# EAGLE design LnControlPanel (EAGLE 9.6.2)

## Sheet 1 of 3
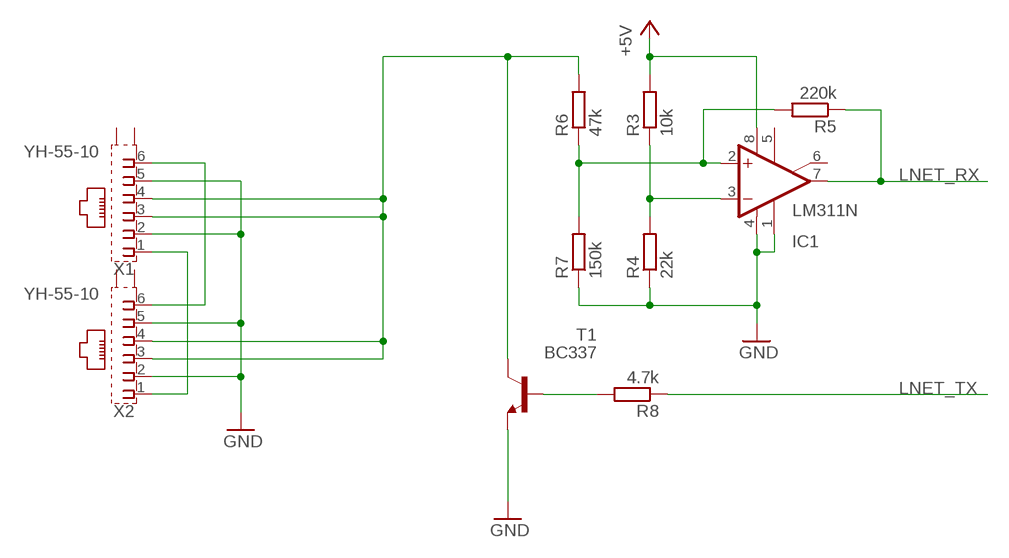
[diagram p0: schematic, sheet 1]

### Parts
IC1  LM311N  [DIL08]
R3  10k  R-EU_0207/2V  [0207/2V]
R4  22k  R-EU_0207/2V  [0207/2V]
R5  220k  R-EU_0207/2V  [0207/2V]
R6  47k  R-EU_0207/2V  [0207/2V]
R7  150k  R-EU_0207/2V  [0207/2V]
R8  4.7k  R-EU_0207/2V  [0207/2V]
T1  BC337  [TO92]
X1  YH-55-10  [YH-55-10]
X2  YH-55-10  [YH-55-10]

### Nets
+5V [power]: IC1.8(V+) R3.2 ; also sheet 2,3
GND [power]: IC1.1(GND) IC1.4(V-) R4.1 R7.1 T1.1(E) X1.2 X1.5 X2.2 X2.5 ; also sheet 2,3
LNET: R6.2 T1.3(C) X1.3 X1.4 X2.3 X2.4
LNET_RX: IC1.7(OUT) R5.1 ; also sheet 2
LNET_TX: R8.1 ; also sheet 2
N$1: R8.2 T1.2(B)
N$3: IC1.3(-IN) R3.1 R4.2
N$5: IC1.2(+IN) R5.2 R6.1 R7.2
N$41: X1.1 X2.1
N$42: X1.6 X2.6
Unconnected: IC1.5(ON) IC1.6(ON/STR) X1.S1(S) X1.S2(S) X2.S1(S) X2.S2(S)

## Sheet 2 of 3
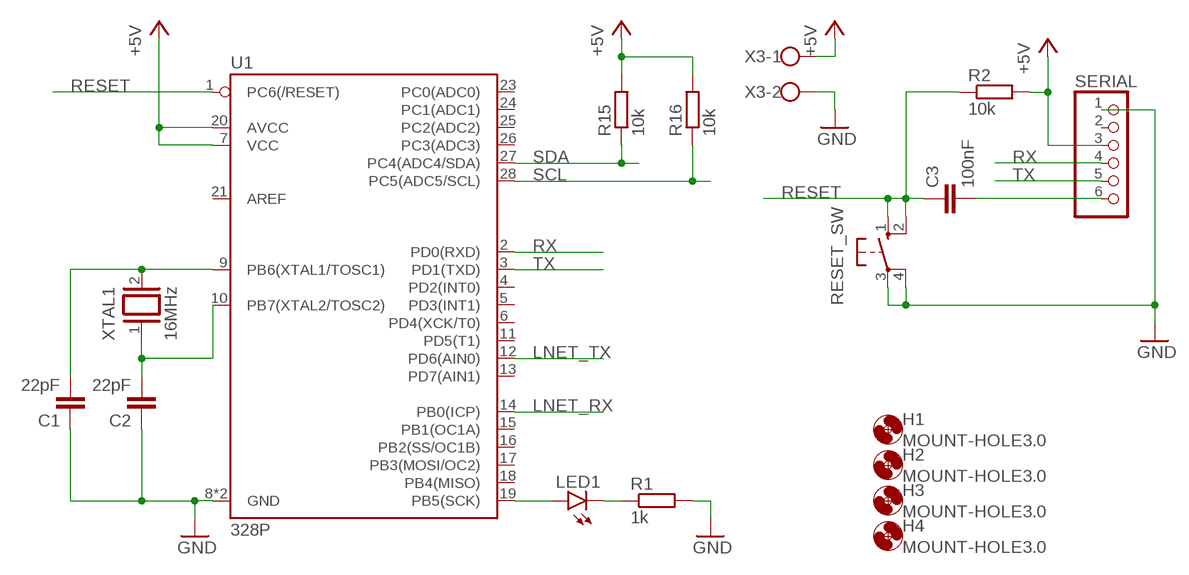
[diagram p1: schematic, sheet 2]

### Parts
C1  22pF  C-EU025-025X050  [C025-025X050]
C2  22pF  C-EU025-025X050  [C025-025X050]
C3  100nF  C-EU050-030X075  [C050-030X075]
H1  MOUNT-HOLE3.0  [3,0]
H2  MOUNT-HOLE3.0  [3,0]
H3  MOUNT-HOLE3.0  [3,0]
H4  MOUNT-HOLE3.0  [3,0]
LED1  LED3MM  [LED3MM]
R1  1k  R-EU_0207/2V  [0207/2V]
R2  10k  R-EU_0207/2V  [0207/2V]
R15  10k  R-EU_0207/2V  [0207/2V]
R16  10k  R-EU_0207/2V  [0207/2V]
RESET_SW  10-XX  [B3F-10XX]
SERIAL  PINHD-1X6  [1X06]
U1  328P  ATMEGA328P_PDIP  [DIP28]
X3  W237-102  [W237-102]
XTAL1  16MHz  XTAL/S  [QS]

### Nets
+5V [power]: R2.2 R15.2 R16.2 SERIAL.3 U1.7(VCC) U1.20(AVCC) X3.1 ; also sheet 1,3
GND [power]: C1.1 C2.1 R1.2 RESET_SW.3(P) RESET_SW.4(P1) SERIAL.1 U1.8(GND) U1.22(GND) X3.2 ; also sheet 1,3
LNET_RX: U1.14(PB0(ICP)) ; also sheet 1
LNET_TX: U1.12(PD6(AIN0)) ; also sheet 1
N$2: C2.2 U1.10(PB7(XTAL2/TOSC2)) XTAL1.1
N$4: C1.2 U1.9(PB6(XTAL1/TOSC1)) XTAL1.2
N$38: C3.2 SERIAL.6
N$39: LED1.A U1.19(PB5(SCK))
N$40: LED1.K(C) R1.1
RESET: C3.1 R2.1 RESET_SW.1(S) RESET_SW.2(S1) U1.1(PC6(/RESET))
RX: SERIAL.4 U1.2(PD0(RXD))
SCL: R16.1 U1.28(PC5(ADC5/SCL)) ; also sheet 3
SDA: R15.1 U1.27(PC4(ADC4/SDA)) ; also sheet 3
TX: SERIAL.5 U1.3(PD1(TXD))
Unconnected: SERIAL.2 U1.4(PD2(INT0)) U1.5(PD3(INT1)) U1.6(PD4(XCK/T0)) U1.11(PD5(T1)) U1.13(PD7(AIN1)) U1.15(PB1(OC1A)) U1.16(PB2(SS/OC1B)) U1.17(PB3(MOSI/OC2)) U1.18(PB4(MISO)) U1.21(AREF) U1.23(PC0(ADC0)) U1.24(PC1(ADC1)) U1.25(PC2(ADC2)) U1.26(PC3(ADC3))

## Sheet 3 of 3
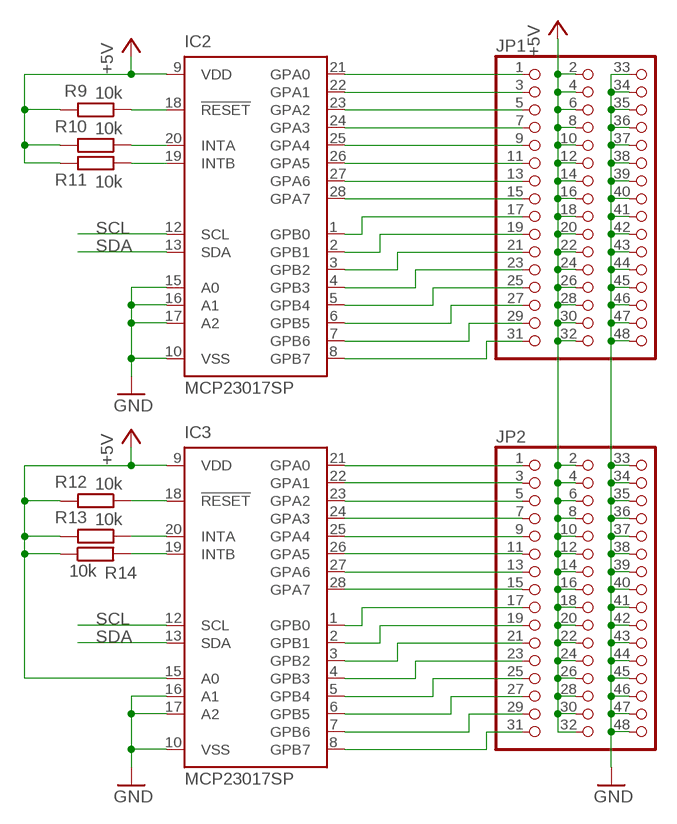
[diagram p2: schematic, sheet 3]

### Parts
IC2  MCP23017SP  [DIL28-3]
IC3  MCP23017SP  [DIL28-3]
JP1  PINHD-3X16  [3X16]
JP2  PINHD-3X16  [3X16]
R9  10k  R-EU_0207/2V  [0207/2V]
R10  10k  R-EU_0207/2V  [0207/2V]
R11  10k  R-EU_0207/2V  [0207/2V]
R12  10k  R-EU_0207/2V  [0207/2V]
R13  10k  R-EU_0207/2V  [0207/2V]
R14  10k  R-EU_0207/2V  [0207/2V]

### Nets
+5V [power]: IC2.9(VDD) IC3.9(VDD) IC3.15(A0) JP1.2 JP1.4 JP1.6 JP1.8 JP1.10 JP1.12 JP1.14 JP1.16 JP1.18 JP1.20 JP1.22 JP1.24 JP1.26 JP1.28 JP1.30 JP1.32 JP2.2 JP2.4 JP2.6 JP2.8 JP2.10 JP2.12 JP2.14 JP2.16 JP2.18 JP2.20 JP2.22 JP2.24 JP2.26 JP2.28 JP2.30 JP2.32 R9.2 R10.2 R11.2 R12.2 R13.2 R14.1 ; also sheet 1,2
GND [power]: IC2.10(VSS) IC2.15(A0) IC2.16(A1) IC2.17(A2) IC3.10(VSS) IC3.16(A1) IC3.17(A2) JP1.33 JP1.34 JP1.35 JP1.36 JP1.37 JP1.38 JP1.39 JP1.40 JP1.41 JP1.42 JP1.43 JP1.44 JP1.45 JP1.46 JP1.47 JP1.48 JP2.33 JP2.34 JP2.35 JP2.36 JP2.37 JP2.38 JP2.39 JP2.40 JP2.41 JP2.42 JP2.43 JP2.44 JP2.45 JP2.46 JP2.47 JP2.48 ; also sheet 1,2
N$6: IC2.21(GPA0) JP1.1
N$7: IC2.22(GPA1) JP1.3
N$8: IC2.23(GPA2) JP1.5
N$9: IC2.24(GPA3) JP1.7
N$10: IC2.25(GPA4) JP1.9
N$11: IC2.26(GPA5) JP1.11
N$12: IC2.27(GPA6) JP1.13
N$13: IC2.28(GPA7) JP1.15
N$14: IC2.1(GPB0) JP1.17
N$15: IC2.2(GPB1) JP1.19
N$16: IC2.3(GPB2) JP1.21
N$17: IC2.4(GPB3) JP1.23
N$18: IC2.5(GPB4) JP1.25
N$19: IC2.6(GPB5) JP1.27
N$20: IC2.7(GPB6) JP1.29
N$21: IC2.8(GPB7) JP1.31
N$22: IC3.21(GPA0) JP2.1
N$23: IC3.22(GPA1) JP2.3
N$24: IC3.23(GPA2) JP2.5
N$25: IC3.24(GPA3) JP2.7
N$26: IC3.25(GPA4) JP2.9
N$27: IC3.26(GPA5) JP2.11
N$28: IC3.27(GPA6) JP2.13
N$29: IC3.28(GPA7) JP2.15
N$30: IC3.1(GPB0) JP2.17
N$31: IC3.2(GPB1) JP2.19
N$32: IC3.3(GPB2) JP2.21
N$33: IC3.4(GPB3) JP2.23
N$34: IC3.5(GPB4) JP2.25
N$35: IC3.6(GPB5) JP2.27
N$36: IC3.7(GPB6) JP2.29
N$37: IC3.8(GPB7) JP2.31
N$43: IC3.18(!RESET) R12.1
N$44: IC2.18(!RESET) R9.1
N$45: IC2.20(INTA) R10.1
N$46: IC2.19(INTB) R11.1
N$47: IC3.20(INTA) R13.1
N$48: IC3.19(INTB) R14.2
SCL: IC2.12(SCL) IC3.12(SCL) ; also sheet 2
SDA: IC2.13(SDA) IC3.13(SDA) ; also sheet 2

## Library data of the parts
C1-C3 = rcl:C-EU: CAPACITOR, European symbol; SPICEPREFIX: C
H1-H4 = holes:MOUNT-HOLE: MOUNTING HOLE with drill center marker
IC1 = linear:LM311: COMPARATOR
IC2 IC3 = microchip:MCP23017: http://ww1.microchip.com/downloads/en/DeviceDoc/21952a.pdf Source: http://ww1.microchip.com/downloads/en/DeviceDoc/21952a.pdf; MF: MICROCHIP; MPN: MCP23017-E/SP; OC_FARNELL: 1332088; OC_NEWARK: 31K2959
JP1 JP2 = LucaDentella:PINHD-3X16: PIN HEADER
LED1 = led:LED: LED OSRAM: - CHIPLED LG R971, LG N971, LY N971, LG Q971, LY Q971, LO R971, LY R971 LH N974, LH R974 LS Q976, LO Q976, LY Q976 LO Q996 - Hyper CHIPLED LW Q18S LB Q993, LB Q99A, LB R99A - SideLED LS A670, LO A670, LY A670, LG A670, LP A670 LB A673, LV A673, LT A673, LW A673 LH A674 LY A675 LS A676, LA A676, LO A676, LY A676, LW A676 LS A679, LY A679, LG A679 - Hyper Micro SIDELED® LS Y876, LA Y876, LO Y876, LY Y876 LT Y87S - SmartLED LW L88C, LW L88S LB L89C, LB L89S, LG L890 LS L89K, LO L89K, LY L89K LS L896, LA L896, LO L896, LY L896 - TOPLED LS T670, LO T670, LY T670, LG T670, LP T670 LSG T670, LSP T670, LSY T670, LOP T670, LYG T670 LG T671, LOG T671, LSG T671 LB T673, LV T673, LT T673, LW T673 LH T674 LS T676, LA T676, LO T676, LY T676, LB T676, LH T676, LSB T676, LW T676 LB T67C, LV T67C, LT T67C, LS T67K, LO T67K, LY T67K, LW E67C LS E67B, LA E67B, LO E67B, LY E67B, LB E67C, LV E67C, LT E67C LW T67C LS T679, LY T679, LG T679 LS T770, LO T770, LY T770, LG T770, LP T770 LB T773, LV T773, LT T773, LW T773 LH T774 LS E675, LA E675, LY E675, LS T675 LS T776, LA T776, LO T776, LY T776, LB T776 LHGB T686 LT T68C, LB T68C - Hyper Mini TOPLED® LB M676 - Mini TOPLED Santana® LG M470 LS M47K, LO M47K, LY M47K Source: http://www.osram.convergy.de LUXEON: - LUMILED® LXK2-PW12-R00, LXK2-PW12-S00, LXK2-PW14-U00, LXK2-PW14-V00 LXK2-PM12-R00, LXK2-PM12-S00, LXK2-PM14-U00 LXK2-PE12-Q00, LXK2-PE12-R00, LXK2-PE12-S00, LXK2-PE14-T00, LXK2-PE14-U00 LXK2-PB12-K00, LXK2-PB12-L00, LXK2-PB12-M00, LXK2-PB14-N00, LXK2-PB14-P00, LXK2-PB14-Q00 LXK2-PR12-L00, LXK2-PR12-M00, LXK2-PR14-Q00, LXK2-PR14-R00 LXK2-PD12-Q00, LXK2-PD12-R00, LXK2-PD12-S00 LXK2-PH12-R00, LXK2-PH12-S00 LXK2-PL12-P00, LXK2-PL12-Q00, LXK2-PL12-R00 Source: www.luxeon.com KINGBRIGHT: KA-3528ASYC Source: www.kingbright.com
R1 R2 R15 R16 = rcl:R-EU_: RESISTOR, European symbol; SPICEPREFIX: R
R3-R14 = rcl:R-EU_: RESISTOR, European symbol
RESET_SW = switch-omron:10-XX: OMRON SWITCH; MPN: B3F-1000; OC_FARNELL: 176432; OC_NEWARK: 36M3542
SERIAL = pinhead:PINHD-1X6: PIN HEADER
T1 = transistor:BC337: NPN TRANSISTOR
U1 = SparkFun-IC-Microcontroller:ATMEGA328P_PDIP: Atmel 328P Through hole ATMEGA328P uC used in the Arduino 32kb flash, 1k EEPROM, 2k SRAM Datasheet <http://www.sparkfun.com/datasheets/Components/SMD/ATMega328.pdf> SparkFun Products Storefront component: AVR 28 Pin 20MHz 32K 6A/D - ATMega328P <https://www.sparkfun.com/products/9061> (COM-09061) SparkFun Simon Says - Through-Hole Soldering Kit <https://www.sparkfun.com/products/10547> (KIT-10547) SparkFun Learn to Solder - Simon Says <https://www.sparkfun.com/products/13708> (KIT-13708) SparkFun BigTime Watch Kit <https://www.sparkfun.com/products/11734> (KIT-11734) SparkFun ClockIt <https://www.sparkfun.com/products/10930> (KIT-10930) SparkFun Serial Enabled LCD Kit <https://www.sparkfun.com/products/10097> (LCD-10097) SparkFun Simon Tilts - Through Hole Soldering Kit <https://www.sparkfun.com/products/12634> (KIT-12634) SparkFun Frequency Counter Kit <https://www.sparkfun.com/products/10140> (KIT-10140) FabFM Radio Kit <https://www.sparkfun.com/products/11043> (KIT-11043) SparkFun Binary Blaster Kit <https://www.sparkfun.com/products/12037> (KIT-12037) SparkFun Metro-Gnome <https://www.sparkfun.com/products/9236> (KIT-09236) ATmega328 with Arduino Optiboot (Uno) <https://www.sparkfun.com/products/10524> (DEV-10524); PROD_ID: IC-09136
X1 X2 = con-wenzhou-yihua:YH-55-10: RJ11 6 connects Source: YH-55-10.pdf; OC_FARNELL: unknown; OC_NEWARK: unknown
X3 = con-wago-500:W237-102: WAGO SCREW CLAMP; MPN: 237-102; OC_FARNELL: unknown; OC_NEWARK: 70K9898
XTAL1 = special:XTAL/S: CRYSTAL

## Net classes
0 default: width 0.254 mm, clearance 0.254 mm
1 power: width 0.508 mm, clearance 0.254 mm

## Board
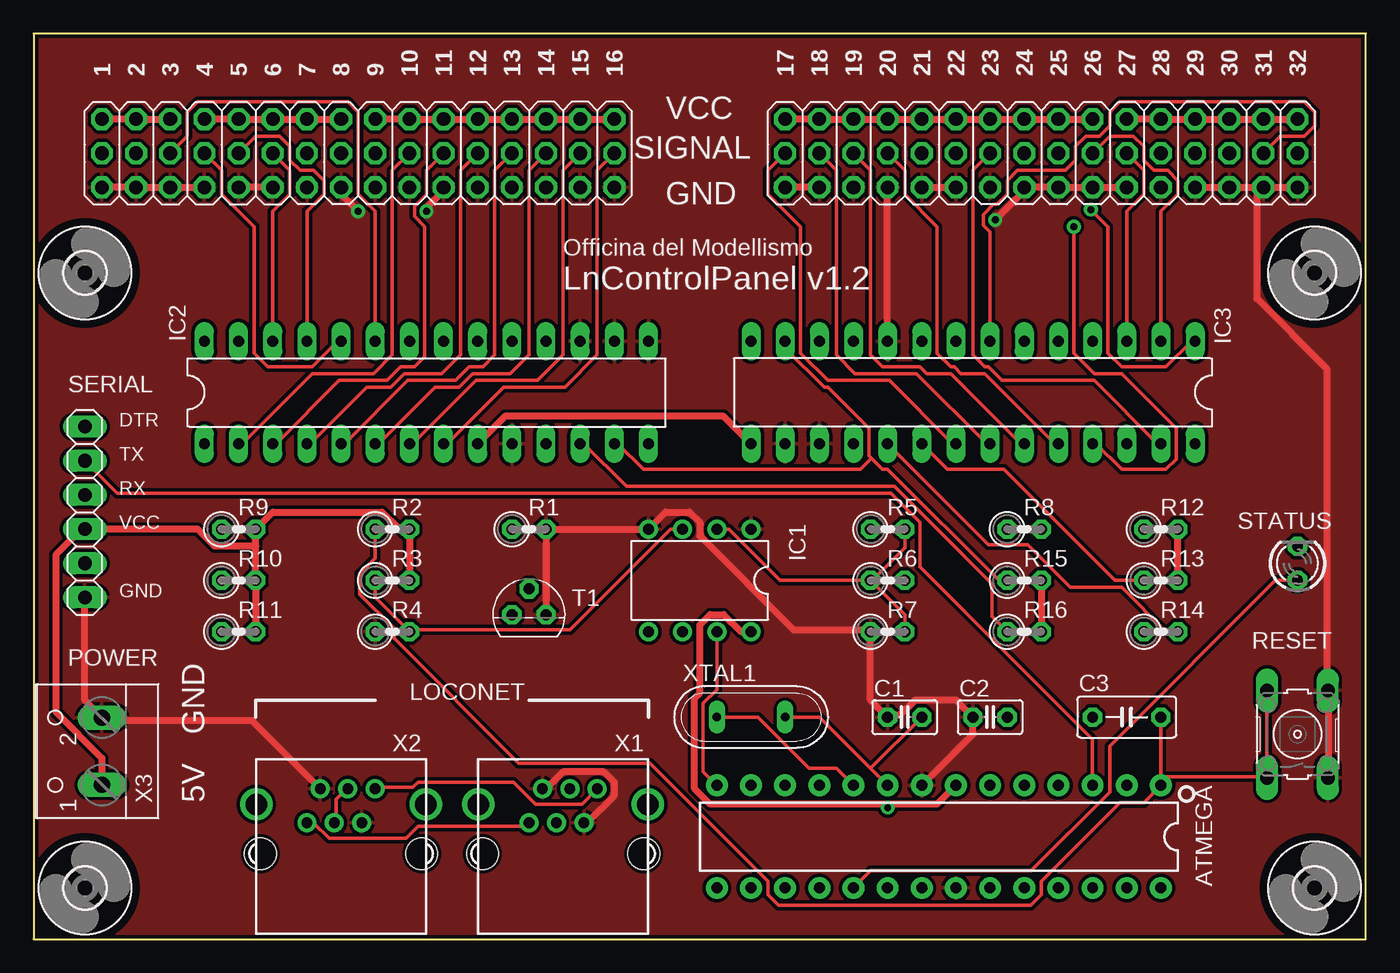
[diagram p3: board, top side]
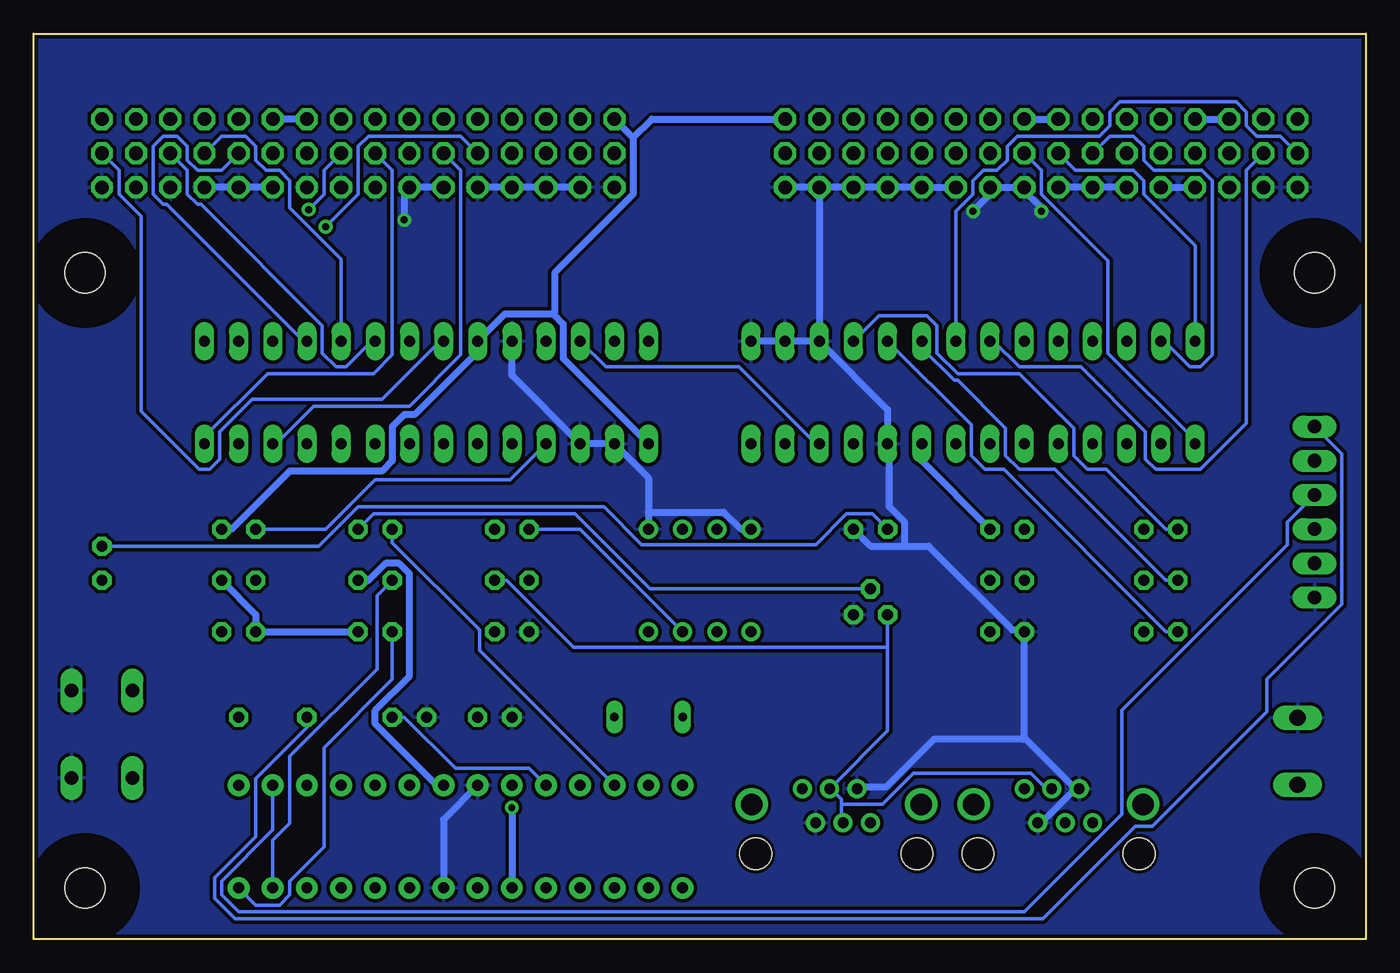
[diagram p4: board, bottom side, seen from below]

Size 99.06 x 67.31 mm. Coordinates in mm from the lower left corner, seen from the top.
Outline: 0,0 99.06,0 99.06,67.31 0,67.31 0,0
Copper layers (1*16): Top 0.035mm / dielectric 1.5mm / Bottom 0.035mm
Design rules "SparkFun": minimum track width 8mil, minimum drill 20mil, track to track 8mil, track to pad 8mil, pad to pad 8mil, via to via 8mil, smd to smd 8mil, copper to edge 10mil, drill to drill 8mil, minimum pad ring 12mil, minimum via ring 10mil, stop-mask expansion 4mil, vias tented up to drill 25mil, thermal gap 10mil

### Footprints (pad centres in the part's own frame; a part is rotated, then mirrored left to right if it is on the bottom)
C025-025X050 = drill 0.813 octagon: 1 -1.27,0; 2 1.27,0
C050-030X075 = drill 0.813 octagon: 1 -2.54,0; 2 2.54,0
3,0 = hole 3: 0,0
DIL08 = drill 0.813 pad 1.27: 1 -3.81,-3.81; 2 -1.27,-3.81; 3 1.27,-3.81; 4 3.81,-3.81; 5 3.81,3.81; 6 1.27,3.81; 7 -1.27,3.81; 8 -3.81,3.81
DIL28-3 = drill 0.813 long: 1 -16.51,-3.81; 2 -13.97,-3.81; 3 -11.43,-3.81; 4 -8.89,-3.81; 5 -6.35,-3.81; 6 -3.81,-3.81; 7 -1.27,-3.81; 8 1.27,-3.81; 9 3.81,-3.81; 10 6.35,-3.81; 11 8.89,-3.81; 12 11.43,-3.81; 13 13.97,-3.81; 14 16.51,-3.81; 15 16.51,3.81; 16 13.97,3.81; 17 11.43,3.81; 18 8.89,3.81; 19 6.35,3.81; 20 3.81,3.81; 21 1.27,3.81; 22 -1.27,3.81; 23 -3.81,3.81; 24 -6.35,3.81; 25 -8.89,3.81; 26 -11.43,3.81; 27 -13.97,3.81; 28 -16.51,3.81
3X16 = drill 1.016 octagon: 1 -19.05,-1.27; 2 -19.05,1.27; 3 -16.51,-1.27; 4 -16.51,1.27; 5 -13.97,-1.27; 6 -13.97,1.27; 7 -11.43,-1.27; 8 -11.43,1.27; 9 -8.89,-1.27; 10 -8.89,1.27; 11 -6.35,-1.27; 12 -6.35,1.27; 13 -3.81,-1.27; 14 -3.81,1.27; 15 -1.27,-1.27; 16 -1.27,1.27; 17 1.27,-1.27; 18 1.27,1.27; 19 3.81,-1.27; 20 3.81,1.27; 21 6.35,-1.27; 22 6.35,1.27; 23 8.89,-1.27; 24 8.89,1.27; 25 11.43,-1.27; 26 11.43,1.27; 27 13.97,-1.27; 28 13.97,1.27; 29 16.51,-1.27; 30 16.51,1.27; 31 19.05,-1.27; 32 19.05,1.27; 33 -19.05,-3.81; 34 -16.51,-3.81; 35 -13.97,-3.81; 36 -11.43,-3.81; 37 -8.89,-3.81; 38 -6.35,-3.81; 39 -3.81,-3.81; 40 -1.27,-3.81; 41 1.27,-3.81; 42 3.81,-3.81; 43 6.35,-3.81; 44 8.89,-3.81; 45 11.43,-3.81; 46 13.97,-3.81; 47 16.51,-3.81; 48 19.05,-3.81
LED3MM = drill 0.813 octagon: A -1.27,0; K 1.27,0
0207/2V = drill 0.813 octagon: 1 -1.27,0; 2 1.27,0
B3F-10XX = drill 1.016 long: 1 -3.251,2.261; 2 3.251,2.261; 3 -3.251,-2.261; 4 3.251,-2.261
1X06 = drill 1.016 long: 1 -6.35,0; 2 -3.81,0; 3 -1.27,0; 4 1.27,0; 5 3.81,0; 6 6.35,0
TO92 = drill 0.813 octagon: 1 1.27,0; 2 0,1.905; 3 -1.27,0
DIP28 = drill 0.813 pad 1.626: 1 -16.51,-3.81; 2 -13.97,-3.81; 3 -11.43,-3.81; 4 -8.89,-3.81; 5 -6.35,-3.81; 6 -3.81,-3.81; 7 -1.27,-3.81; 8 1.27,-3.81; 9 3.81,-3.81; 10 6.35,-3.81; 11 8.89,-3.81; 12 11.43,-3.81; 13 13.97,-3.81; 14 16.51,-3.81; 15 16.51,3.81; 16 13.97,3.81; 17 11.43,3.81; 18 8.89,3.81; 19 6.35,3.81; 20 3.81,3.81; 21 1.27,3.81; 22 -1.27,3.81; 23 -3.81,3.81; 24 -6.35,3.81; 25 -8.89,3.81; 26 -11.43,3.81; 27 -13.97,3.81; 28 -16.51,3.81
YH-55-10 = drill 0.8 pad 1.3: 1 -2.54,2.3; 2 -1.54,4.84; 3 -0.5,2.3; 4 0.5,4.84; 5 1.54,2.3; 6 2.54,4.84 | drill 1.6 pad 2.184: S1 -6.3,3.68; S2 6.3,3.68 | hole 2.36: -6,0; 6,0
W237-102 = drill 1.194 long: 1 -2.5,-1.27; 2 2.5,-1.27
QS = drill 0.61 long: 1 -2.54,0; 2 2.54,0

### Placement (x,y rotation side)
C1  64.77,16.51 0 top
C2  71.12,16.51 0 top
C3  81.28,16.51 180 top
H1  3.81,49.53 0 top
H2  95.25,49.53 0 top
H3  3.81,3.81 0 top
H4  95.25,3.81 0 top
IC1  49.53,26.67 180 top
IC2  29.21,40.64 0 top
IC3  69.85,40.64 180 top
JP1  24.13,59.69 0 top
JP2  74.93,59.69 0 top
LED1  93.98,27.94 90 top
R1  36.83,30.48 0 top
R2  26.67,30.48 0 top
R3  26.67,26.67 0 top
R4  26.67,22.86 0 top
R5  63.5,30.48 0 top
R6  63.5,26.67 0 top
R7  63.5,22.86 0 top
R8  73.66,30.48 0 top
R9  15.24,30.48 0 top
R10  15.24,26.67 0 top
R11  15.24,22.86 0 top
R12  83.82,30.48 0 top
R13  83.82,26.67 0 top
R14  83.82,22.86 0 top
R15  73.66,26.67 0 top
R16  73.66,22.86 0 top
RESET_SW  93.98,15.24 90 top
SERIAL  3.81,31.75 90 top
T1  36.83,24.13 0 top
U1  67.31,7.62 180 top
X1  39.37,6.35 0 top
X2  22.86,6.35 0 top
X3  3.81,13.97 90 top
XTAL1  53.34,16.51 0 top

### Tracks (layer width: path | path; a pad name or v marks a point on that pad's centre or on a via)
+5V  (via drill 0.51)
  Top 0.508: R15.2 R16.2 | R13.2 R12.2 | IC1.8 52.58,22.86 51.31,24.13 50.29,24.13 49.53,23.37 49.53,18.29 49.15,17.91 49.15,11.18 50.29,10.03 63.5,10.03 | 63.5,10.03 67.18,10.03 U1.7 | v63.5,9.78 63.5,10.03 | R3.2 R2.2 27.81,30.61 27.05,30.61 25.91,31.75 17.78,31.75 R9.2 16.51,29.21 | R11.2 R10.2 16.51,29.21 | 16.51,29.21 13.46,29.21 12.19,30.48 SERIAL.3 3.68,30.61 1.65,28.58 1.65,16.89 5.08,13.46 X3.1 | JP1.2 JP1.4 JP1.6 | JP1.8 JP1.10 JP1.12 JP1.14 JP1.16 | JP1.18 JP1.20 JP1.22 JP1.24 JP1.26 JP1.28 JP1.30 JP1.32 | JP2.22 JP2.24 JP2.26 JP2.28 JP2.30 JP2.32 | JP2.2 JP2.4 JP2.6 JP2.8 JP2.10 JP2.12 JP2.14 JP2.16 JP2.18 JP2.20 | IC2.9 35.05,38.86 51.31,38.86 IC3.15
  Bottom 0.508: R13.2 82.55,24.13 R14.1 R16.2 | v63.5,9.78 U1.20 | R15.2 74.17,26.67 72.9,27.94 71.88,27.94 71.12,27.18 71.12,19.56 73.66,17.02 73.66,16 69.09,11.43 U1.7 | IC2.9 33.02,35.56 R2.2 | JP1.8 JP1.6 | JP1.18 JP1.16 | IC3.15 59.69,43.18 59.69,45.72 60.45,46.48 | 60.45,46.48 64.01,46.48 IC3.9 66.17,44.32 66.17,43.56 70.74,38.99 71.5,38.99 72.39,38.1 72.39,35.56 73.15,34.8 80.01,34.8 84.33,30.48 R12.2 | JP2.20 JP2.22 | 54.48,59.56 54.48,55.37 60.33,49.53 60.33,46.61 60.45,46.48 | JP2.2 54.48,59.56 | JP1.32 53.09,60.96 54.48,59.56
GND  (via drill 0.51)
  Top 0.508: RESET_SW.3 96.27,12.06 96.27,18.41 RESET_SW.4 96.14,18.67 96.14,42.42 90.93,47.62 90.93,55.75 JP2.47 | JP2.43 JP2.42 JP2.41 JP2.40 73.53,55.75 73.53,55.5 v71.5,53.47 | JP2.45 JP2.46 JP2.47 | JP2.47 JP2.48 | JP1.33 JP1.34 JP1.35 JP1.36 | JP1.38 JP1.37 | v29.21,54.1 29.21,54.36 30.48,55.63 JP1.43 | JP1.40 22.86,55.37 v24.13,54.1 | SERIAL.1 3.81,17.78 5.08,16.51 X3.2 5.21,16.26 16.26,16.26 21.21,11.3 X2.2 | X1.2 37.85,11.3 38.23,11.3 39.37,12.45 42.42,12.45 43.18,11.68 43.18,10.67 41.27,8.76 41.02,8.76 X1.5 | U1.8 69.85,15.24 C2.1 68.58,17.78 65.53,17.78 64.39,16.64 63.63,16.64 C1.1 62.23,17.78 R7.1 62.1,22.99 56.52,22.99 49.53,29.97 49.53,30.99 48.77,31.75 46.99,31.75 IC1.4 R1.2 T1.1 | JP2.34 JP2.33 | JP2.37 JP2.38 | IC3.10 JP2.36
  Bottom 0.508: JP2.43 JP2.44 JP2.45 | JP1.38 JP1.39 JP1.40 | JP1.37 JP1.36 | IC2.17 35.56,39.37 IC2.10 35.43,36.7 35.43,32.13 34.29,30.99 34.29,29.21 | IC2.17 IC2.16 IC2.15 | JP1.43 JP1.44 JP1.45 JP1.46 JP1.47 | JP1.47 JP1.48 | v29.21,54.1 28.07,55.25 28.07,55.75 JP1.42 JP1.41 25.53,55.75 24.13,54.36 v24.13,54.1 | JP1.47 IC2.17 | X2.5 24.38,8.76 24,8.76 21.59,11.18 21.34,11.18 X2.2 21.72,11.3 25.4,14.99 | 25.4,14.99 R4.1 25.53,22.99 26.29,22.99 32.51,29.21 34.29,29.21 | X1.2 37.72,11.3 35.69,11.3 32.13,14.86 25.53,14.86 25.4,14.99 | U1.22 68.58,8.89 U1.8 | JP2.34 JP2.35 JP2.36 JP2.37 | JP2.38 JP2.39 71.5,55.5 v71.5,53.47 | 53.34,31.75 53.34,34.29 IC3.16 IC3.17 63.5,41.91 IC3.10 | 53.34,31.75 IC1.1 | IC1.4 46.48,30.48 47.75,31.75 53.34,31.75 | 34.29,29.21 36.83,29.21 R1.2
  pour Bottom (isolate 0.406, no thermals): 99.06,67.31 99.06,1.27 99.06,0
  pour Bottom: 0,67.31 99.06,67.31 99.06,0 0,0
  pour Top: 0,67.31 99.06,67.31 99.06,0 0,0
LNET
  Top 0.254: X2.3 22.48,8.76 22.48,10.41 23.24,11.18 X2.4
  Bottom 0.254: 38.99,10.03 38.99,10.41 39.75,11.18 X1.4 39.75,11.3 35.56,15.49 35.56,21.72 | 38.99,10.03 38.99,8.76 X1.3 | 35.56,21.72 T1.3 | R6.2 63.88,26.67 58.93,21.72 35.56,21.72 | 38.99,10.03 35.94,10.03 33.66,12.32 24.89,12.32 23.88,11.3 23.37,11.3 X2.4
LNET_RX
  Top 0.254: IC1.7 50.8,18.54 49.78,17.53 49.78,12.45 U1.14
  Bottom 0.254: R5.1 58.42,30.48 IC1.7
LNET_TX
  Bottom 0.254: R8.1 72.39,29.46 65.91,22.99 65.91,21.46 U1.12
N$1
  Bottom 0.254: T1.2 53.21,26.03 58.8,31.62 73.79,31.62 R8.2
N$2
  Top 0.254: XTAL1.1 53.85,16.51 57.66,12.7 59.69,12.7 U1.10
  Bottom 0.254: C2.2 71.5,16.51 67.69,12.7 62.23,12.7 U1.10
N$3
  Top 0.254: R3.1 25.4,25.4 R4.2 27.94,22.99 39.88,22.99 47.37,30.48 IC1.3
N$4
  Top 0.254: XTAL1.2 58.42,16.51 62.23,12.7 | U1.9 62.23,12.7 | 62.23,12.7 C1.2
N$5
  Top 0.254: R7.2 64.77,24.13 R6.1 | IC1.2 51.69,30.48 55.5,26.67 R6.1 | R5.2 64.77,29.08 62.36,26.67 R6.1
N$6
  Bottom 0.254: IC2.21 30.48,54.1 29.21,55.37 29.21,56.39 28.45,57.15 27.43,57.15 26.67,57.91 26.67,58.93 25.91,59.69 19.81,59.69 19.05,60.45 19.05,61.47 18.29,62.23 9.65,62.23 8.89,61.47 8.89,60.45 8.13,59.69 6.35,59.69 JP1.1
N$7
  Bottom 0.254: IC2.22 27.69,44.45 25.78,42.55 21.21,42.55 16.38,37.72 16.38,35.69 15.62,34.92 12.32,34.92 8.89,38.35 8.89,57.15 JP1.3
N$8
  Top 0.254: IC2.23 25.4,54.1 24.13,55.37 24.13,61.47 23.37,62.23 12.19,62.23 11.43,61.47 11.43,59.69 JP1.5
N$9
  Top 0.254: IC2.24 22.61,44.45 20.7,42.55 17.4,42.55 16.38,43.56 16.38,52.96 13.97,55.37 13.97,57.15 JP1.7
N$10
  Top 0.254: IC2.25 20.32,54.1 21.59,55.37 21.59,56.39 20.83,57.15 19.81,57.15 19.05,57.91 19.05,58.93 18.29,59.69 16.51,59.69 JP1.9
N$11
  Top 0.254: IC2.26 17.78,54.1 19.05,55.37 19.05,57.15 JP1.11
N$12
  Bottom 0.254: IC2.27 14.99,44.45 13.08,42.55 12.32,42.55 11.43,43.43 11.43,56.39 12.19,57.15 15.75,57.15 16.51,57.91 16.51,58.93 17.27,59.69 19.05,59.69 JP1.13
N$13
  Bottom 0.254: IC2.28 12.7,51.56 16.51,55.37 16.51,56.39 17.27,57.15 21.59,57.15 JP1.15
N$14
  Bottom 0.254: IC2.1 12.7,37.08 19.18,43.56 19.18,50.42 24.13,55.37 24.13,57.15 JP1.17
N$15
  Top 0.254: IC2.2 15.49,36.83 20.7,42.04 25.27,42.04 26.67,43.43 26.67,57.15 JP1.19
N$16
  Top 0.254: IC2.3 18.03,36.83 22.73,41.53 26.29,41.53 27.3,42.55 28.32,42.55 29.08,43.31 29.08,52.96 28.32,53.72 28.32,54.48 29.21,55.37 29.21,57.15 JP1.21
N$17
  Top 0.254: IC2.4 20.57,36.83 24.77,41.02 26.54,41.02 27.56,42.04 30.35,42.04 31.75,43.43 31.75,57.15 JP1.23
N$18
  Top 0.254: IC2.5 23.11,36.83 27.81,41.53 31.37,41.53 32.38,42.55 33.4,42.55 34.29,43.43 34.29,57.15 JP1.25
N$19
  Top 0.254: IC2.6 25.65,36.83 29.84,41.02 31.62,41.02 32.64,42.04 35.43,42.04 36.83,43.43 36.83,57.15 JP1.27
N$20
  Top 0.254: IC2.7 28.19,36.83 32.89,41.53 37.47,41.53 39.37,43.43 39.37,57.15 JP1.29
N$21
  Top 0.254: IC2.8 30.73,36.83 34.92,41.02 39.5,41.02 41.91,43.43 41.91,57.15 JP1.31
N$22
  Top 0.254: IC3.21 68.33,36.83 63.63,41.53 59.05,41.53 57.02,43.56 57.02,52.96 54.61,55.37 54.61,57.15 JP2.1
N$23
  Top 0.254: IC3.22 70.87,36.83 65.66,42.04 61.09,42.04 59.69,43.43 59.69,57.15 JP2.3
N$24
  Top 0.254: IC3.23 73.41,36.83 68.2,42.04 66.42,42.04 65.91,42.55 63.12,42.55 62.23,43.43 62.23,57.15 JP2.5
N$25
  Top 0.254: IC3.24 75.95,36.83 70.74,42.04 68.96,42.04 68.45,42.55 68.2,42.55 67.18,43.56 67.18,52.96 64.77,55.37 64.77,57.15 JP2.7
N$26  (via drill 0.51)
  Top 0.254: IC3.25 78.99,36.83 80.9,34.92 84.2,34.92 84.96,35.69 84.96,37.97 80.9,42.04 78.87,42.04 77.34,43.56 v77.34,52.96
  Bottom 0.254: v77.34,52.96 74.93,55.37 74.93,58.93 74.17,59.69 67.31,59.69 JP2.9
N$27
  Bottom 0.254: IC3.26 81.03,36.83 78.23,39.62 71.12,39.62 67.31,43.43 67.31,57.15 JP2.11
N$28
  Top 0.254: IC3.27 83.57,36.83 78.87,41.53 72.01,41.53 70.99,42.55 70.74,42.55 69.85,43.43 69.85,57.15 JP2.13
N$29
  Bottom 0.254: IC3.28 86.36,37.34 81.66,42.04 73.79,42.04 72.39,43.43 72.39,57.15 JP2.15
N$30  (via drill 0.51)
  Top 0.254: IC3.1 86.11,44.45 84.2,42.55 80.9,42.55 79.88,43.56 79.88,52.96 v78.61,54.23
  Bottom 0.254: v78.61,54.23 77.47,55.37 77.47,57.15 JP2.17
N$31
  Top 0.254: IC3.2 83.82,54.1 85.09,55.37 85.09,56.39 84.33,57.15 83.31,57.15 82.55,57.91 82.55,58.93 81.79,59.69 80.01,59.69 JP2.19
N$32
  Top 0.254: IC3.3 81.28,54.1 82.55,55.37 82.55,57.15 JP2.21
N$33
  Bottom 0.254: IC3.4 78.99,44.45 89.15,54.61 89.41,54.61 90.17,55.37 90.17,58.93 89.41,59.69 88.39,59.69 87.63,58.93 87.63,57.91 86.87,57.15 85.09,57.15 JP2.23
N$34
  Bottom 0.254: IC3.5 76.2,50.55 80.01,54.36 80.01,56.39 80.77,57.15 81.79,57.15 82.55,57.91 82.55,58.93 83.31,59.69 85.09,59.69 JP2.25
N$35
  Bottom 0.254: IC3.6 73.91,44.45 75.82,42.55 76.58,42.55 77.6,43.56 77.6,45.59 86.61,54.61 86.87,54.61 87.63,55.37 87.63,57.15 JP2.27
N$36
  Top 0.254: IC3.7 71.12,52.58 70.61,53.09 70.61,53.85 71.37,54.61 71.63,54.61 72.39,55.37 72.39,56.39 73.15,57.15 76.71,57.15 77.47,57.91 77.47,58.93 78.23,59.69 79.25,59.69 80.01,60.45 80.01,61.47 80.77,62.23 94.49,62.23 95.25,61.47 95.25,60.45 94.49,59.69 92.71,59.69 JP2.29
N$37
  Bottom 0.254: IC3.8 68.83,44.45 73.15,40.13 82.8,40.13 85.22,37.72 85.22,35.69 85.98,34.92 86.74,34.92 91.06,39.24 91.06,53.72 92.71,55.37 92.71,57.15 JP2.31
N$38
  Bottom 0.254: C3.2 78.74,15.75 82.55,11.94 82.55,7.62 85.6,4.57 85.6,3.05 84.07,1.52 24,1.52 17.14,8.38 15.88,8.38 7.37,16.89 7.37,19.3 1.78,24.89 1.78,36.07 SERIAL.6
N$39
  Top 0.254: LED1.A 92.33,26.67 80.01,14.35 80.01,10.92 74.17,5.08 62.23,5.08 U1.19
N$40
  Bottom 0.254: LED1.K 77.85,29.21 74.93,32.13 56.64,32.13 53.85,29.34 40.89,29.34 38.61,31.62 36.7,31.62 R1.1
N$41
  Top 0.254: X2.1 20.32,8.64 20.83,8.64 21.97,7.49 27.69,7.49 28.57,8.38 36.58,8.38 36.83,8.64 X1.1
N$42
  Top 0.254: X2.6 25.4,11.3 28.19,11.3 28.57,11.68 35.69,11.68 37.34,10.03 40.77,10.03 41.91,11.18 X1.6
N$43
  Bottom 0.254: R12.1 77.34,30.48 73.66,34.16 63.63,34.16 IC3.18
N$44
  Bottom 0.254: R9.1 14.86,30.48 19.3,34.92 20.7,34.92 21.72,35.94 21.72,37.97 25.78,42.04 30.35,42.04 31.88,43.56 31.88,45.59 32.64,46.36 36.2,46.36 IC2.18
N$45
  Bottom 0.254: R10.1 14.86,26.67 23.11,34.92 25.78,34.92 26.8,35.94 26.8,37.97 30.35,41.53 30.61,41.53 33.02,43.94 IC2.20
N$46
  Bottom 0.254: R11.1 14.86,22.86 26.92,34.92 28.32,34.92 29.34,35.94 29.34,38.23 IC2.19
N$47
  Top 0.254: R13.1 80.39,26.67 72.14,34.92 67.94,34.92 IC3.20
N$48
  Top 0.254: R14.2 84.2,22.86 80.9,26.16 77.09,26.16 73.91,29.34 70.99,29.34 IC3.19
RESET
  Top 0.254: RESET_SW.2 91.69,18.41 91.69,12.06 RESET_SW.1 91.57,12.06 83.82,12.06 | 83.82,12.06 C3.1 | R2.1 25.4,28.32 24.26,27.18 24.26,25.65 26.8,23.11 26.8,22.35 36.07,13.08 45.85,13.08 54.61,4.32 54.61,3.3 55.37,2.54 74.17,2.54 74.93,3.3 74.93,4.32 80.77,10.16 82.55,10.16 U1.1 83.82,12.06
RX
  Bottom 0.254: U1.2 81.28,8.13 85.09,4.32 85.09,3.3 83.82,2.03 25.4,2.03 18.16,9.27 18.16,17.02 5.84,29.34 5.84,30.99 SERIAL.4
SCL
  Top 0.254: IC2.12 40.89,36.83 44.07,33.66 64.01,33.66 71.25,26.42 71.25,24 R16.1
  Bottom 0.254: IC2.12 40.89,36.83 46.61,42.55 56.52,42.55 IC3.12 | R16.1 72.39,19.3 77.47,14.22 77.47,6.86 80.01,4.32 80.01,3.3 80.77,2.54 82.55,2.54 U1.28
SDA
  Top 0.254: R15.1 71.75,26.67 63.5,34.92 63.12,34.92 62.29,35.75 | 62.29,35.75 62.1,35.94 62.1,37.97 59.05,41.02 58.8,41.02 55.88,43.94 IC3.13 | IC2.13 43.43,36.83 45.34,34.92 61.47,34.92 62.29,35.75
  Bottom 0.254: U1.27 81.28,7.37 80.01,8.64 80.01,13.59 73.53,20.07 73.53,25.53 R15.1
TX
  Top 0.254: U1.3 78.74,14.86 65.91,27.69 65.91,30.99 63.75,33.15 6.22,33.15 SERIAL.5

### Text on the board
tPlace: 1 | 2 | 3 | 4 | 5 | 6 | 7 | 8 | 9 | 10 | 11 | 12 | 13 | 14 | 15 | 16 | 17 | 18 | 19 | 20 | 21 | 22 | 23 | 24 | 25 | 26 | 27 | 28 | 29 | 30 | 31 | 32 | VCC | SIGNAL | GND | Officina del Modellismo | LnControlPanel v1.2 | SERIAL | DTR | TX | RX | STATUS | VCC | GND | RESET | POWER | LOCONET | GND | ATMEGA | 5V